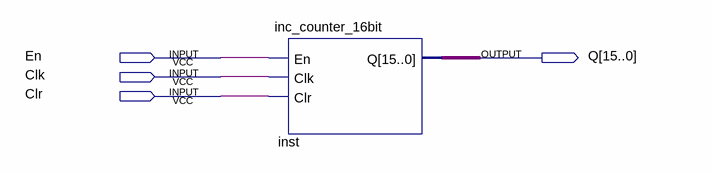
[diagram p0: schematic sheet]
// Quartus schematic Lab4Part2.bdf as structural Verilog: 1 symbols, 4 pins
module Lab4Part2 (
  input  En,
  input  Clk,
  input  Clr,
  output [15:0] Q
);

  inc_counter_16bit inst (.En(En), .Clk(Clk), .Clr(Clr), .Q(Q));
endmodule
